# Altium project InsaneKeyboard_Right - Copy.PrjPcb (part 1 of 2)
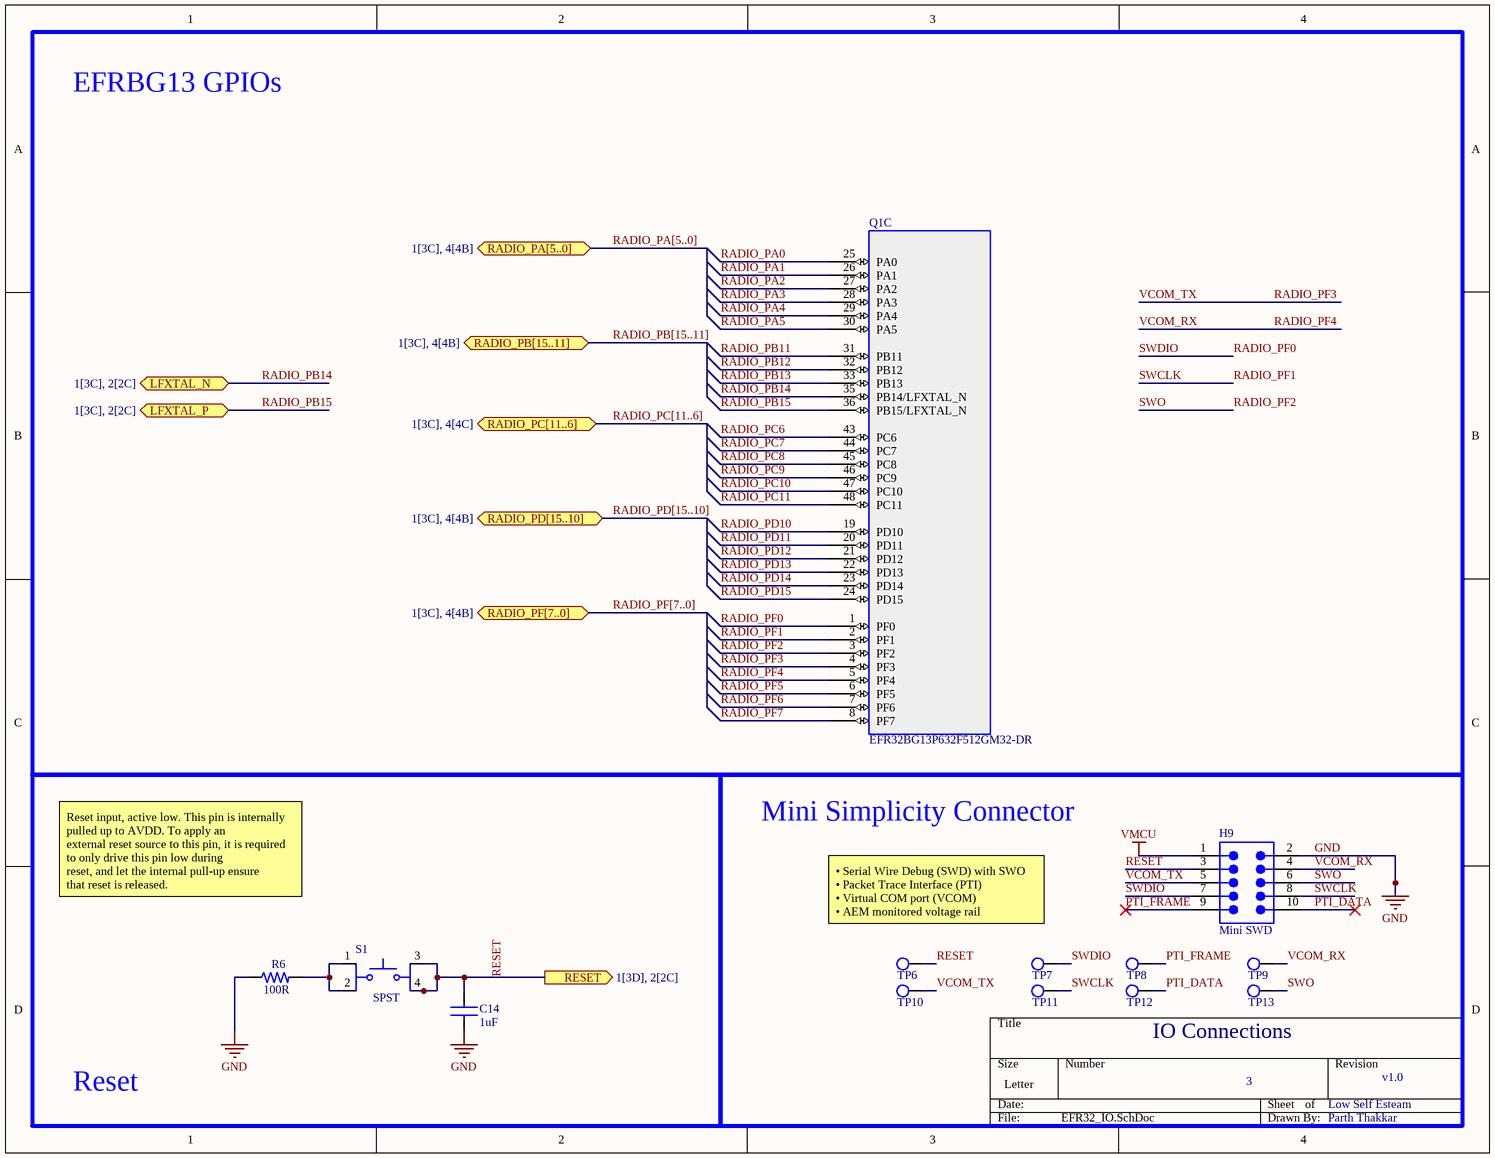
[diagram p0:  EFR32_IO.SchDoc]
3 sheets, 128 parts. Net scope: hierarchical (ports join the sheet entries above them; power ports are global).
Board file:  InsaneKeyboard.PcbDoc
Sheets:
   EFR32_IO.SchDoc
   Peripherals.SchDoc
   Lights.SchDoc

## Sheet  EFR32_IO.SchDoc: IO Connections
size Letter; Author: Parth Thakkar; Organization: Low Self Esteam; Revision: v1.0; SheetNumber: 3; SheetTotal: 8

### Parts
C14  value 1uF  [Capacitor 0603]  (hidden comment: CAP 1uF 10V 0603)
H9  Mini SWD  [Mini Simplicity Connector]
Q1  EFR32BG13P632F512GM32-DR  [EFR32BG]  (part C of 3)
R6  value 100R  [Resistor 0603]  (hidden comment: RES 100R 0603)
S1  SPST  [SPST]
TP6  Test point  [Test Point]  (value not drawn)  (no BOM)
TP7  Test point  [Test Point]  (value not drawn)  (no BOM)
TP8  Test point  [Test Point]  (value not drawn)  (no BOM)
TP9  Test point  [Test Point]  (value not drawn)  (no BOM)
TP10  Test point  [Test Point]  (value not drawn)  (no BOM)
TP11  Test point  [Test Point]  (value not drawn)  (no BOM)
TP12  Test point  [Test Point]  (value not drawn)  (no BOM)
TP13  Test point  [Test Point]  (value not drawn)  (no BOM)

### Blocks framed on the sheet
EFRBG13 GPIOs: Q1
Reset: C14 R6 S1
Mini Simplicity Connector: H9 TP6-TP13

### Ports
LFXTAL_N (bidir, see 1[3C], 2[2C]), LFXTAL_P (bidir, see 1[3C], 2[2C]), RADIO_PA[5..0] (bidir, see 1[3C], 4[4B]), RADIO_PB[15..11] (bidir, see 1[3C], 4[4B]), RADIO_PC[11..6] (bidir, see 1[3C], 4[4C]), RADIO_PD[15..10] (bidir, see 1[3C], 4[4B]), RADIO_PF[7..0] (bidir, see 1[3C], 4[4B]), RESET (out, see 1[3D], 2[2C])

### Nets
GND: C14.2 H9.2 R6.1
VMCU: H9.1
PTI_DATA: H9.10 TP12.1
PTI_FRAME: H9.9 TP8.1
RADIO_PA0: Q1.25(PA0)
RADIO_PA1: Q1.26(PA1)
RADIO_PA2: Q1.27(PA2)
RADIO_PA3: Q1.28(PA3)
RADIO_PA4: Q1.29(PA4)
RADIO_PA5: Q1.30(PA5)
RADIO_PB11: Q1.31(PB11)
RADIO_PB12: Q1.32(PB12)
RADIO_PB13: Q1.33(PB13)
RADIO_PB14: Q1.35(PB14/LFXTAL_N) ; port LFXTAL_N
RADIO_PB15: Q1.36(PB15/LFXTAL_N) ; port LFXTAL_P
RADIO_PC6: Q1.43(PC6)
RADIO_PC7: Q1.44(PC7)
RADIO_PC8: Q1.45(PC8)
RADIO_PC9: Q1.46(PC9)
RADIO_PC10: Q1.47(PC10)
RADIO_PC11: Q1.48(PC11)
RADIO_PD10: Q1.19(PD10)
RADIO_PD11: Q1.20(PD11)
RADIO_PD12: Q1.21(PD12)
RADIO_PD13: Q1.22(PD13)
RADIO_PD14: Q1.23(PD14)
RADIO_PD15: Q1.24(PD15)
RADIO_PF0: H9.7 Q1.1(PF0) TP7.1  [also labelled SWDIO]
RADIO_PF1: H9.8 Q1.2(PF1) TP11.1  [also labelled SWCLK]
RADIO_PF2: H9.6 Q1.3(PF2) TP13.1  [also labelled SWO]
RADIO_PF3: H9.5 Q1.4(PF3) TP10.1  [also labelled VCOM_TX]
RADIO_PF4: H9.4 Q1.5(PF4) TP9.1  [also labelled VCOM_RX]
RADIO_PF5: Q1.6(PF5)
RADIO_PF6: Q1.7(PF6)
RADIO_PF7: Q1.8(PF7)
RESET: C14.1 H9.3 S1.3 S1.4 TP6.1 ; port RESET
NetR6_2: R6.2 S1.1 S1.2

### Buses and harness runs
bus RADIO_PA[5..0] = port RADIO_PA[5..0]
bus RADIO_PB[15..11] = port RADIO_PB[15..11]
bus RADIO_PC[11..6] = port RADIO_PC[11..6]
bus RADIO_PD[15..10] = port RADIO_PD[15..10]
bus RADIO_PF[7..0] = port RADIO_PF[7..0]

### Notes on the sheet
- Reset input, active low. This pin is internally
  pulled up to AVDD. To apply an
  external reset source to this pin, it is required
  to only drive this pin low during
  reset, and let the internal pull-up ensure
  that reset is released.
- • Serial Wire Debug (SWD) with SWO
  • Packet Trace Interface (PTI)
  • Virtual COM port (VCOM)
  • AEM monitored voltage rail

### Library data of the parts
C14 = CAP 1uF 10V 0603: Ceramic Capacitor, Multilayer, Ceramic, 10V, 10% +Tol, 10% -Tol, X5R, 15% TC, 1uF, Surface Mount, 0603; Manufacturer: Murata; Manufacturer Part Number: GRM188R61A105KA61D; Multilayer: Yes; Supplier: Digikey; Supplier Part Number: 490-1543-1-ND; RoHS: Yes; Category: Ceramic Capacitors; Stock: 2506225; Pricing: 1=0.1, 10=0.059, 50=0.0408, 100=0.0354, 500=0.0261, 1000=0.02321 (USD); Mounting Technology: Surface Mount; Pins: 2; Dielectric Material: Ceramic; Package Shape: Rectangular; Case/Package: 0603; Terminal Finish: Nickel; Min Operating Temperature: -55°C; Max Operating Temperature: 85°C; JESD-609 Code: e3; Capacitor Type: Ceramic; Tolerance  (fill in as +-): 10%; Package Style: SMTMeter; Packaging: Tape and Reel; Tolerance (fill in as +-): 10%; Rated DC Voltage (URdc): 10V; Temperature Characteristics Code: X5R; Termination: Wraparound; Length: 1.6mm; Width: 0.8mm; Height: 0.8mm; Reach SVHC Compliant: Yes; RoHS Compliant: Yes; ComponentLink1URL: https://psearch.en.murata.com:443/capacitor/product/GRM188R61A105KA61%23.pdf?src-supplier=IHS+Markit; ComponentLink1Description: https://psearch.en.murata.com:443/capacitor/product/GRM188R61A105KA61%23.pdf?src-supplier=IHS+Markit; ComponentLink2URL: https://datasheet.ciiva.com/18102/getdatasheetpartid-85467-18102910.pdf?src-supplier=Verical; ComponentLink2Description: https://datasheet.ciiva.com/18102/getdatasheetpartid-85467-18102910.pdf?src-supplier=Verical; ComponentLink3URL: https://datasheet.ciiva.com/19476/1857381-19476568.pdf?src-supplier=Jameco; ComponentLink3Description: https://datasheet.ciiva.com/19476/1857381-19476568.pdf?src-supplier=Jameco; ComponentLink4URL: https://datasheet.ciiva.com/7719/608985-7719036.pdf?src-supplier=Element14; ComponentLink4Description: https://datasheet.ciiva.com/7719/608985-7719036.pdf?src-supplier=Element14; ComponentLink5URL: https://datasheet.ciiva.com/22706/608985-22706782.pdf?src-supplier=Element14; ComponentLink5Description: https://datasheet.ciiva.com/22706/608985-22706782.pdf?src-supplier=Element14; ComponentLink6URL: https://datasheet.ciiva.com/131/partnumbering-e-01-131741.pdf?src-supplier=Digikey; ComponentLink6Description: https://datasheet.ciiva.com/131/partnumbering-e-01-131741.pdf?src-supplier=Digikey; ComponentLink7URL: https://datasheet.ciiva.com/131/partnumbering-e-01-131742.pdf?src-supplier=Digikey; ComponentLink7Description: https://datasheet.ciiva.com/131/partnumbering-e-01-131742.pdf?src-supplier=Digikey; ComponentLink8URL: https://datasheet.ciiva.com/131/partnumbering-e-01-131743.pdf?src-supplier=Digikey; ComponentLink8Description: https://datasheet.ciiva.com/131/partnumbering-e-01-131743.pdf?src-supplier=Digikey; ComponentLink9URL: https://datasheet.ciiva.com/16199/product-16199724.pdf?src-supplier=Future+Electronics; ComponentLink9Description: https://datasheet.ciiva.com/16199/product-16199724.pdf?src-supplier=Future+Electronics
H9 = Debug Connector Mini SWD - 0.05": Mini SWD 0.05" Pitch Connector - 10 Pin SMT Box Header; Manufacturer: Adafruit Industries; Manufacturer Part Number: 4048; Supplier 1: Digi-Key; RoHS: No; Category: Connectors; Stock 1: 201; Pricing 1: 1=1.95000 (USD); ComponentLink1URL: https://media.digikey.com/pdf/Data%20Sheets/Adafruit%20PDFs/4048_Web.pdf?src-supplier=Digi-Key; ComponentLink1Description: https://media.digikey.com/pdf/Data%20Sheets/Adafruit%20PDFs/4048_Web.pdf?src-supplier=Digi-Key
Q1 = EFR32BG13P632F512GM32-DR: BLue Gecko; Manufacturer: Silicon Labs; Supplier: Digikey; Supplier Part Number: 336-EFR32BG13P632F512GM32-DRCT-ND; Manufacturer Part Number: EFR32BG13P632F512GM32-DR; RoHS: No; Category: RF Receivers, Transceivers; Stock: 30445; Pricing: 1=6.93, 10=6.355, 25=5.7772, 100=5.1995, 250=4.7662, 500=4.3329, 1000=3.89961 (USD); RoHS Compliant: Yes; ComponentLink1URL: https://www.silabs.com/documents/login/data-sheets/efr32bg13-datasheet.pdf?src-supplier=Digikey; ComponentLink1Description: https://www.silabs.com/documents/login/data-sheets/efr32bg13-datasheet.pdf?src-supplier=Digikey
R6 = RES 100R 0603: Fixed Resistor, Metal Glaze/thick Film, 0.1W, 100ohm, 75V, 1% +/-Tol, 100ppm/Cel, Surface Mount, 0603; Manufacturer: Yageo; Manufacturer Part Number: RC0603FR-07100RL; Additional Feature: LASER TRIMMABLE; Power: 100mW; Rated Temperature: 70°C; Temperature Coefficient: 100ppm/°C; Package Height: 0.45mm; Package Length: 1.6mm; Package Width: 0.8mm; Supplier: Digikey; Supplier Part Number: 311-100HRCT-ND; RoHS: Yes; Category: Chip SMD Resistors; Stock: 2134400; Pricing: 1=0.1, 10=0.019, 50=0.0112, 100=0.0093, 500=0.00622, 1000=0.00532, 5000=0.00382, 10000=0.00335, 25000=0.00287, 35000=0.00278, 50000=0.00257, 125000=0.00232 (USD); Mounting Technology: Surface Mount; Pins: 2; Package Shape: Rectangular; Case/Package: 0603; Terminal Finish: Nickel; Min Operating Temperature: -55°C; Max Operating Temperature: 155°C; Tolerance: 1%; JESD-609 Code: e3; Resistor Type: FIXED RESISTOR; Construction: Chip; Package Style: SMTMeter; Packaging: Tape and Reel; Technology: METAL GLAZE/THICK FILM; Termination: Wraparound; Working Voltage: 75V; Reach SVHC Compliant: Yes; RoHS Compliant: Yes; ComponentLink1URL: https://datasheet.ciiva.com:443/pdfs/VipMasterIC/IC/YAGO/YAGO-S-A0008145938/YAGO-S-A0008145938-1.pdf?src-supplier=IHS+Markit; ComponentLink1Description: https://datasheet.ciiva.com:443/pdfs/VipMasterIC/IC/YAGO/YAGO-S-A0008145938/YAGO-S-A0008145938-1.pdf?src-supplier=IHS+Markit
S1 = SPST: Keypad Switch, 1 Switches, SPST, Momentary-tactile, 0.05A, 50VDC, 2.55N, Solder Terminal, Surface Mount-straight; Manufacturer: E-Switch; Manufacturer Part Number: TL3301NF260QG; Circuit Configuration: 1X1; Contact Current(DC)-Max: 50mA; Contact DC Max Rating R Load: .05A@50VDC; Contact Voltage(DC)-Max: 50V; Number of Switches: 1; Operating Force-Max: 3.04N; Body Breadth: 6inch; Body Height: 3.6mm; Body Length or Diameter: 6mm; Supplier: Digikey; Supplier Part Number: EG1868CT-ND; RoHS: Yes; Category: Tactile Switches; Stock: 45667; Pricing: 1=0.42, 10=0.404, 25=0.3804, 100=0.3303, 250=0.29968, 500=0.27876 (USD); Mounting Technology: Surface Mount; Terminal Finish: Silver; JESD-609 Code: e4; Packaging: Tape and Reel; Switch Action: MOMENTARY-TACTILE; Switch Function: SPST; Switch Type: Keypad; Termination: Solder; Reach SVHC Compliant: Yes; RoHS Compliant: Yes; ComponentLink1URL: https://datasheet.ciiva.com:443/pdfs/VipMasterIC/IC/ESCH/ESCH-S-A0005350531/ESCH-S-A0005350531-1.pdf?src-supplier=IHS+Markit; ComponentLink1Description: https://datasheet.ciiva.com:443/pdfs/VipMasterIC/IC/ESCH/ESCH-S-A0005350531/ESCH-S-A0005350531-1.pdf?src-supplier=IHS+Markit; ComponentLink2URL: https://datasheet.ciiva.com/2901/p010517e-2901296.pdf?src-supplier=Digikey; ComponentLink2Description: https://datasheet.ciiva.com/2901/p010517e-2901296.pdf?src-supplier=Digikey; ComponentLink3URL: https://datasheet.ciiva.com/2901/tl3301-2901294.pdf?src-supplier=Digikey; ComponentLink3Description: https://datasheet.ciiva.com/2901/tl3301-2901294.pdf?src-supplier=Digikey; ComponentLink4URL: https://datasheet.ciiva.com/2901/tl3301-2901295.pdf?src-supplier=Digikey; ComponentLink4Description: https://datasheet.ciiva.com/2901/tl3301-2901295.pdf?src-supplier=Digikey; ComponentLink5URL: https://datasheet.ciiva.com/7637/tl3301-7637661.pdf?src-supplier=Element14; ComponentLink5Description: https://datasheet.ciiva.com/7637/tl3301-7637661.pdf?src-supplier=Element14

## Sheet  Peripherals.SchDoc: Peripharals
size Letter; Author: Parth Thakkar; CompanyName: Insane Corp; Organization: Low Self Esteem; SheetNumber: 4; SheetTotal: 8
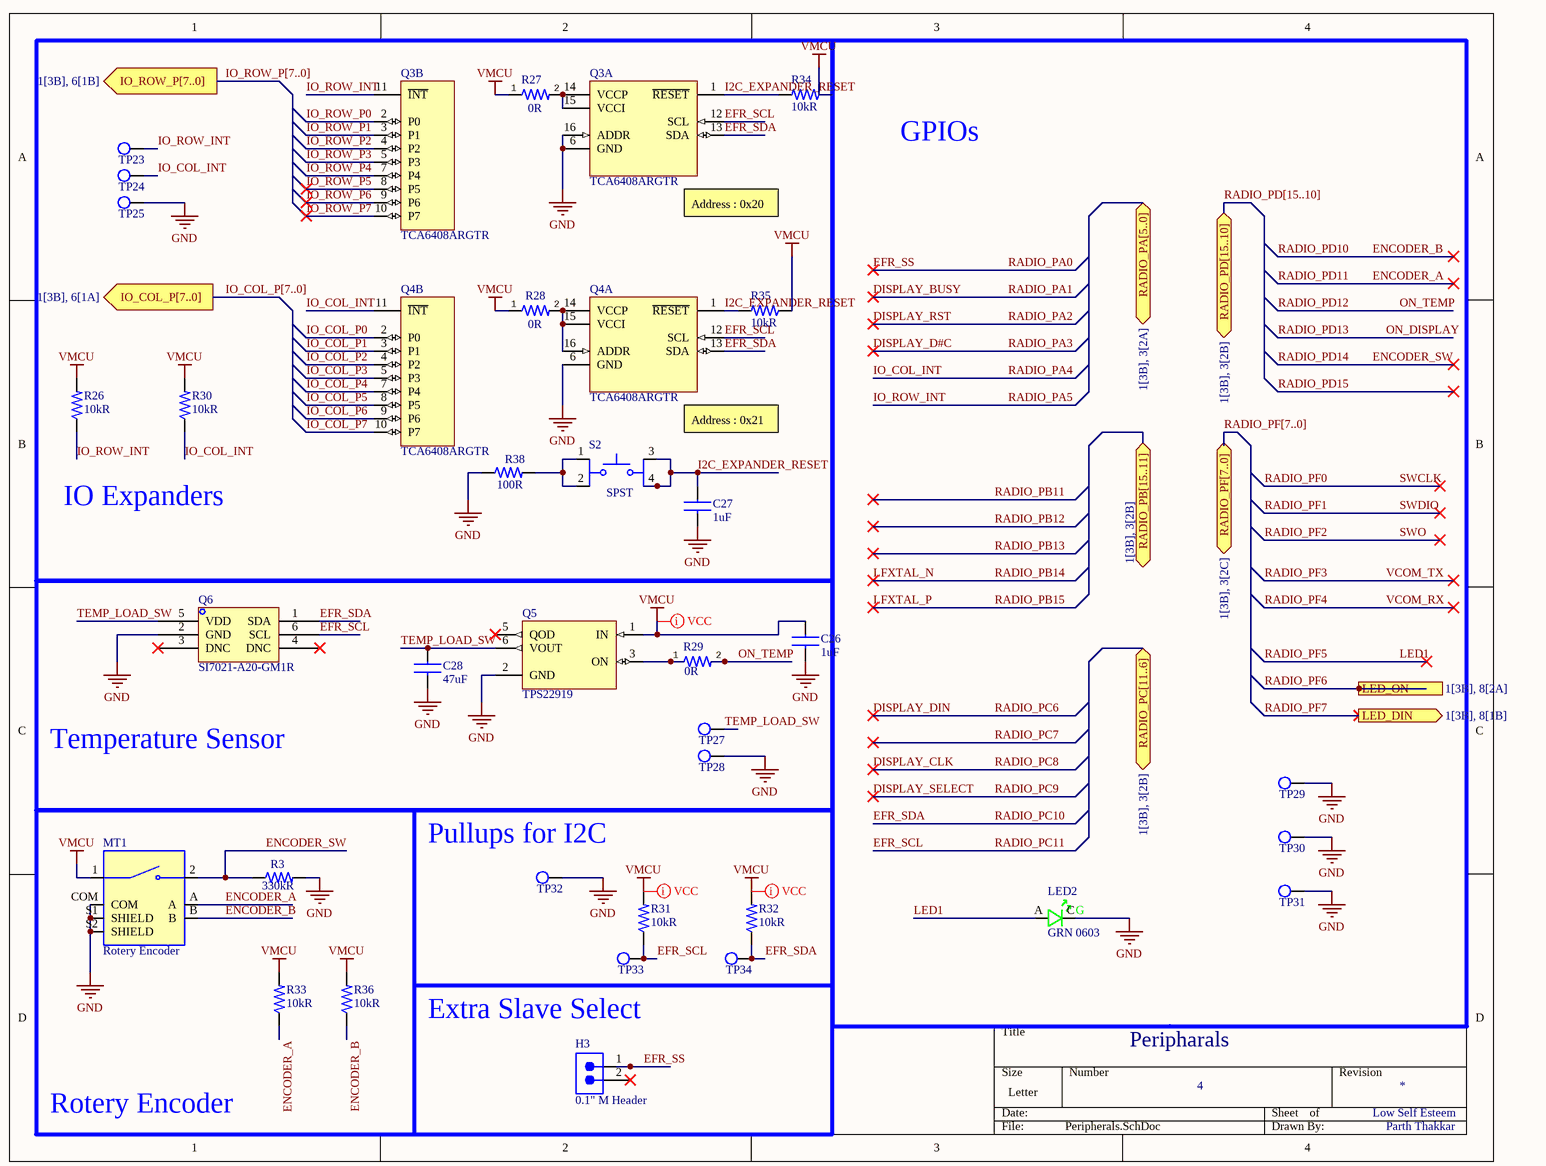
[diagram p1:  Peripherals.SchDoc]

### Parts
C26  value 1uF  [Capacitor 0603]  (hidden comment: CAP 1uF 10V 0603)
C27  value 1uF  [Capacitor 0603]  (hidden comment: CAP 1uF 10V 0603)
C28  value 47uF  [CAPACITOR 0805]  (hidden comment: CAP 47uF 10V 0805)
H3  0.1" M Header  [2-PIN_MALE_HEADER_01-IN]
LED2  GRN 0603  [LED 0603]
MT1  Rotery Encoder  [Rotery Encoder]
Q3  TCA6408ARGTR  [TCA6408ARGTR - IO Expander]  (parts A,B of 2)
Q4  TCA6408ARGTR  [TCA6408ARGTR - IO Expander]  (parts A,B of 2)
Q5  TPS22919  [TPS22919DCKR - Load SW]
Q6  SI7021-A20-GM1R  [Si7021-A20 - Temp]
R3  value 330kR  [Resistor 0603]  (hidden comment: RES 330K 0603)
R26  value 10kR  [Resistor 0603]  (hidden comment: RES 10K 0603)
R27  value 0R  [Resistor 0402]  (hidden comment: RES 0R 0402)
R28  value 0R  [Resistor 0402]  (hidden comment: RES 0R 0402)
R29  value 0R  [Resistor 0402]  (hidden comment: RES 0R 0402)
R30  value 10kR  [Resistor 0603]  (hidden comment: RES 10K 0603)
R31  value 10kR  [Resistor 0603]  (hidden comment: RES 10K 0603)
R32  value 10kR  [Resistor 0603]  (hidden comment: RES 10K 0603)
R33  value 10kR  [Resistor 0603]  (hidden comment: RES 10K 0603)
R34  value 10kR  [Resistor 0603]  (hidden comment: RES 10K 0603)
R35  value 10kR  [Resistor 0603]  (hidden comment: RES 10K 0603)
R36  value 10kR  [Resistor 0603]  (hidden comment: RES 10K 0603)
R38  value 100R  [Resistor 0603]  (hidden comment: RES 100R 0603)
S2  SPST  [SPST]
TP23  Test point  [Test Point]  (value not drawn)  (no BOM)
TP24  Test point  [Test Point]  (value not drawn)  (no BOM)
TP25  Test point  [Test Point]  (value not drawn)  (no BOM)
TP27  Test point  [Test Point]  (value not drawn)  (no BOM)
TP28  Test point  [Test Point]  (value not drawn)  (no BOM)
TP29  Test point  [Test Point]  (value not drawn)  (no BOM)
TP30  Test point  [Test Point]  (value not drawn)  (no BOM)
TP31  Test point  [Test Point]  (value not drawn)  (no BOM)
TP32  Test point  [Test Point]  (value not drawn)  (no BOM)
TP33  Test point  [Test Point]  (value not drawn)  (no BOM)
TP34  Test point  [Test Point]  (value not drawn)  (no BOM)

### Blocks framed on the sheet
IO Expanders: C27 Q3 Q4 R26-R28 R30 R34 R35 R38 S2 TP23-TP25
GPIOs: LED2 TP29-TP31
Temperature Sensor: C26 C28 Q5 Q6 R29 TP27 TP28
Rotery Encoder: MT1 R3 R33 R36
Pullups for I2C: R31 R32 TP32-TP34
Extra Slave Select: H3

### Ports
IO_COL_P[7..0] (out, see 1[3B], 6[1A]), IO_ROW_P[7..0] (out, see 1[3B], 6[1B]), LED_DIN (out, see 1[3B], 8[1B]), LED_ON (out, see 1[3B], 8[2A]), RADIO_PA[5..0] (bidir, see 1[3B], 3[2A]), RADIO_PB[15..11] (bidir, see 1[3B], 3[2B]), RADIO_PC[11..6] (bidir, see 1[3B], 3[2B]), RADIO_PD[15..10] (bidir, see 1[3B], 3[2B]), RADIO_PF[7..0] (bidir, see 1[3B], 3[2C])

### Nets
GND: C26.2 C27.2 C28.2 LED2.C MT1.COM MT1.S1(SHIELD) MT1.S2(SHIELD) Q3.6(GND) Q3.16(ADDR) Q4.6(GND) Q5.2(GND) Q6.2(GND) R3.2 R38.1 TP25.1 TP28.1 TP29.1 TP30.1 TP31.1 TP32.1
VMCU: C26.1 MT1.1 Q5.1(IN) R26.2 R27.1 R28.1 R30.2 R31.2 R32.2 R33.2 R34.1 R35.1 R36.2
EFR_SCL: Q3.12(SCL) Q4.12(SCL) Q6.6(SCL) R31.1 TP33.1  [also labelled RADIO_PC11]
EFR_SDA: Q3.13(SDA) Q4.13(SDA) Q6.1(SDA) R32.1 TP34.1  [also labelled RADIO_PC10]
EFR_SS: H3.1  [also labelled RADIO_PA0]
ENCODER_A: MT1.A R33.1  [also labelled RADIO_PD11]
ENCODER_B: MT1.B R36.1  [also labelled RADIO_PD10]
ENCODER_SW: MT1.2 R3.1  [also labelled RADIO_PD14]
I2C_EXPANDER_RESET: C27.1 Q3.1(~{RESET}) Q4.1(~{RESET}) R34.2 R35.2 S2.3 S2.4
IO_COL_INT: Q4.11(~{INT}) R30.1 TP24.1  [also labelled RADIO_PA4]
IO_COL_P0: Q4.2(P0)
IO_COL_P1: Q4.3(P1)
IO_COL_P2: Q4.4(P2)
IO_COL_P3: Q4.5(P3)
IO_COL_P4: Q4.7(P4)
IO_COL_P5: Q4.8(P5)
IO_COL_P6: Q4.9(P6)
IO_COL_P7: Q4.10(P7)
IO_ROW_INT: Q3.11(~{INT}) R26.1 TP23.1  [also labelled RADIO_PA5]
IO_ROW_P0: Q3.2(P0)
IO_ROW_P1: Q3.3(P1)
IO_ROW_P2: Q3.4(P2)
IO_ROW_P3: Q3.5(P3)
IO_ROW_P4: Q3.7(P4)
IO_ROW_P5: Q3.8(P5)
IO_ROW_P6: Q3.9(P6)
IO_ROW_P7: Q3.10(P7)
LED1: LED2.A  [also labelled RADIO_PF5]
ON_TEMP: R29.2  [also labelled RADIO_PD12]
RADIO_PF6: port LED_ON
RADIO_PF7: port LED_DIN
TEMP_LOAD_SW: C28.1 Q5.6(VOUT) Q6.5(VDD) TP27.1
NetQ3_14: Q3.14(VCCP) Q3.15(VCCI) R27.2
NetQ4_14: Q4.14(VCCP) Q4.15(VCCI) Q4.16(ADDR) R28.2
NetQ5_3: Q5.3(ON) R29.1
NetR38_2: R38.2 S2.1 S2.2

Not connected (* = marked no-connect by the designer): H3 2*; Q5 5(QOD)*; Q6 3(DNC)* 4(DNC)*

### Buses and harness runs
bus IO_COL_P[7..0] = port IO_COL_P[7..0]
bus IO_ROW_P[7..0] = port IO_ROW_P[7..0]
bus RADIO_PD[15..10] = port RADIO_PD[15..10]
bus RADIO_PF[7..0] = port RADIO_PF[7..0]

### Layout directives
rule Width Constraint [Pref Width = 20mil    Min Width = 6mil    Max Width = 20mil]: VMCU

### Notes on the sheet
- (near Q3) Address : 0x20
- Address : 0x21

### Library data of the parts
C26 C27 = CAP 1uF 10V 0603: as C14 on sheet  EFR32_IO; Supplier: Digikey; Supplier Part Number: 490-1543-1-ND; RoHS: Yes; Category: Ceramic Capacitors; Stock: 2506225; Pricing: 1=0.1, 10=0.059, 50=0.0408, 100=0.0354, 500=0.0261, 1000=0.02321 (USD); Mounting Technology: Surface Mount; Pins: 2; Dielectric Material: Ceramic; Package Shape: Rectangular; Case/Package: 0603; Terminal Finish: Nickel; Min Operating Temperature: -55°C; Max Operating Temperature: 85°C; JESD-609 Code: e3; Capacitor Type: Ceramic; Tolerance  (fill in as +-): 10%; Package Style: SMTMeter; Packaging: Tape and Reel; Tolerance (fill in as +-): 10%; Rated DC Voltage (URdc): 10V; Temperature Characteristics Code: X5R; Termination: Wraparound; Length: 1.6mm; Width: 0.8mm; Height: 0.8mm; Reach SVHC Compliant: Yes; RoHS Compliant: Yes; ComponentLink1URL: https://psearch.en.murata.com:443/capacitor/product/GRM188R61A105KA61%23.pdf?src-supplier=IHS+Markit; ComponentLink1Description: https://psearch.en.murata.com:443/capacitor/product/GRM188R61A105KA61%23.pdf?src-supplier=IHS+Markit; ComponentLink2URL: https://datasheet.ciiva.com/18102/getdatasheetpartid-85467-18102910.pdf?src-supplier=Verical; ComponentLink2Description: https://datasheet.ciiva.com/18102/getdatasheetpartid-85467-18102910.pdf?src-supplier=Verical; ComponentLink3URL: https://datasheet.ciiva.com/19476/1857381-19476568.pdf?src-supplier=Jameco; ComponentLink3Description: https://datasheet.ciiva.com/19476/1857381-19476568.pdf?src-supplier=Jameco; ComponentLink4URL: https://datasheet.ciiva.com/7719/608985-7719036.pdf?src-supplier=Element14; ComponentLink4Description: https://datasheet.ciiva.com/7719/608985-7719036.pdf?src-supplier=Element14; ComponentLink5URL: https://datasheet.ciiva.com/22706/608985-22706782.pdf?src-supplier=Element14; ComponentLink5Description: https://datasheet.ciiva.com/22706/608985-22706782.pdf?src-supplier=Element14; ComponentLink6URL: https://datasheet.ciiva.com/131/partnumbering-e-01-131741.pdf?src-supplier=Digikey; ComponentLink6Description: https://datasheet.ciiva.com/131/partnumbering-e-01-131741.pdf?src-supplier=Digikey; ComponentLink7URL: https://datasheet.ciiva.com/131/partnumbering-e-01-131742.pdf?src-supplier=Digikey; ComponentLink7Description: https://datasheet.ciiva.com/131/partnumbering-e-01-131742.pdf?src-supplier=Digikey; ComponentLink8URL: https://datasheet.ciiva.com/131/partnumbering-e-01-131743.pdf?src-supplier=Digikey; ComponentLink8Description: https://datasheet.ciiva.com/131/partnumbering-e-01-131743.pdf?src-supplier=Digikey; ComponentLink9URL: https://datasheet.ciiva.com/16199/product-16199724.pdf?src-supplier=Future+Electronics; ComponentLink9Description: https://datasheet.ciiva.com/16199/product-16199724.pdf?src-supplier=Future+Electronics
C28 = CAP 47uF 10V 0805: Multilayer Ceramic Capacitors MLCC - SMD/SMT 0805 47uF 10volts *Derate Voltage/Temp; Manufacturer: Murata; Manufacturer Part Number: GRM21BR61A476ME15K; Tolerance: 20%; Dielectric: X5R; Supplier: Digikey; Supplier Part Number: 490-GRM21BR61A476ME15KCT-ND; RoHS: Yes; Category: Ceramic Capacitors; Stock: 143272; Pricing: 1=0.72, 10=0.435, 50=0.3216, 100=0.2864, 500=0.22636, 1000=0.20762, 2500=0.18771, 5000=0.17563 (USD); Mounting Technology: Surface Mount; Case/Package: 0805; Case Code (Imperial): 0805; Case Code (Metric): 2012; Weight: 0.000335oz; Material: Ceramic; Min Operating Temperature: -55°C; Max Operating Temperature: 85°C; Packaging: Tape and Reel; Voltage Rating: 10V; Termination: SMD/SMT; Voltage Rating (DC): 10V; Package Quantity: 10000; Series: GRM; Height: 1.45mm; RoHS Compliant: Yes; ComponentLink1URL: http://www.mouser.com/ds/2/281/c02e-2905.pdf?src-supplier=Mouser; ComponentLink1Description: http://www.mouser.com/ds/2/281/c02e-2905.pdf?src-supplier=Mouser; ComponentLink2URL: https://www.murata.com/~/media/webrenewal/support/library/catalog/products/capacitor/mlcc/c02e.ashx?la=en-us&src-supplier=Digikey; ComponentLink2Description: https://www.murata.com/~/media/webrenewal/support/library/catalog/products/capacitor/mlcc/c02e.ashx?la=en-us&src-supplier=Digikey; ComponentLink3URL: http://psearch.en.murata.com/capacitor/product/GRM21BR61A476ME15%23.pdf?src-supplier=Avnet; ComponentLink3Description: http://psearch.en.murata.com/capacitor/product/GRM21BR61A476ME15%23.pdf?src-supplier=Avnet; ComponentLink4URL: https://datasheet.octopart.com/GRM21BR61A476ME15K-Murata-datasheet-155345080.pdf?src-supplier=Newark; ComponentLink4Description: https://datasheet.octopart.com/GRM21BR61A476ME15K-Murata-datasheet-155345080.pdf?src-supplier=Newark; ComponentLink5URL: https://datasheet.octopart.com/GRM21BR61A476ME15K-Murata-datasheet-141278181.pdf?src-supplier=Future+Electronics; ComponentLink5Description: https://datasheet.octopart.com/GRM21BR61A476ME15K-Murata-datasheet-141278181.pdf?src-supplier=Future+Electronics; ComponentLink6URL: https://datasheet.octopart.com/GRM21BR61A476ME15K-Murata-datasheet-155345080.pdf?src-supplier=Element14; ComponentLink6Description: https://datasheet.octopart.com/GRM21BR61A476ME15K-Murata-datasheet-155345080.pdf?src-supplier=Element14; ComponentLink7URL: https://datasheet.octopart.com/GRM21BR61A476ME15K-Murata-datasheet-165579666.pdf?src-supplier=TME; ComponentLink7Description: https://datasheet.octopart.com/GRM21BR61A476ME15K-Murata-datasheet-165579666.pdf?src-supplier=TME
H3 = PRPC002SAAN-RC: CONN HEADER VERT 2POS 2.54MM; Manufacturer: Sullins; Connector Type: Header, Unshrouded, Breakaway; Number of Positions: 2; Number of Positions Loaded: All; Pitch: 0.100" (2.54mm); Online Catalog: 0.100" (2.54mm) Pitch Connector Headers; Other Names: S9510E-02  S9510E-02-ND; Supplier 1: Digi-Key; Manufacturer Part Number: PRPC002SAAN-RC; Stock 1: 42739; Pricing 1: 1=0.08, 10=0.073, 25=0.054, 50=0.0464, 100=0.0449, 250=0.0387, 500=0.0372 (USD); Standard Package: 1; Category: Connectors, Interconnects; Family: Rectangular Connectors - Headers, Male Pins; Series: -; Packaging: Bulk; Contact Type: Male Pin; Number of Rows: 1; Row Spacing: -; Contact Mating Length: 0.230" (5.84mm); Mounting Type: Through Hole; Termination: Solder; Fastening Type: -; Features: -; Contact Finish: Gold; Contact Finish Thickness: Flash; Color: Black; ComponentLink1URL: https://media.digikey.com/PDF/Data%20Sheets/Sullins%20PDFs/xRxCzzzSxxN-RC_ST_11635-B.pdf?src-supplier=Digi-Key; ComponentLink1Description: https://media.digikey.com/PDF/Data%20Sheets/Sullins%20PDFs/xRxCzzzSxxN-RC_ST_11635-B.pdf?src-supplier=Digi-Key; Supplier Part Number 1: S1011EC-02-ND
LED2 = LED Green 0603: LED, 0603, GREEN, 430MCD, 520NM; Manufacturer: Wurth Electronics; Manufacturer Part Number: 150060GS75000; Dynamic Catalog: 0603 Rectangle with Flat Top Chip LEDs; 3D Model: SMCW_0603.igs / SMCW_0603.stp / SMCW_0603.wrl; Wavelength - Peak: 515nm; Voltage - Forward (Vf) (Typ): 3.2V; Current - Test: 20mA; Viewing Angle: 140°; Lens Type: Clear; Lens Style/Size: Rectangle with Flat Top, 1.1mm x 0.7mm; Other Names: 732-4971-2; Supplier 1: Digi-Key; Stock 1: 34964; Pricing 1: 1=0.14, 50=0.129, 100=0.11, 500=0.095 (USD); Standard Package: 4,000; Category: Optoelectronics; Family: LED Indication - Discrete; Series: WL-SMCW; Packaging: Tape & Reel (TR); Color: Green; Wavelength - Dominant: 520nm; Millicandela Rating: 430mcd; Package / Case: 0603 (1608 Metric); Size / Dimension: 1.60mm L x 0.80mm W; Height: 0.70mm; Mounting Type: Surface Mount; Online Catalog: 0603 Rectangle with Flat Top Chip LEDs; ComponentLink1URL: https://katalog.we-online.de/led/datasheet/150060GS75000.pdf?src-supplier=Digi-Key; ComponentLink1Description: https://katalog.we-online.de/led/datasheet/150060GS75000.pdf?src-supplier=Digi-Key; ComponentLink2URL: http://www.produktinfo.conrad.com/datenblaetter/750000-774999/759427-da-01-en-CHIPLED_0603_W_KL_GRUEN_150060GS75000.pdf?src-supplier=Conrad; ComponentLink2Description: http://www.produktinfo.conrad.com/datenblaetter/750000-774999/759427-da-01-en-CHIPLED_0603_W_KL_GRUEN_150060GS75000.pdf?src-supplier=Conrad; Supplier Part Number 1: 732-4971-1-ND
MT1 = Rotery Encoder: Rotary Position Encoder, Single, 2 Channels; Manufacturer: Bourns; Manufacturer Part Number: PEC12R-4222F-S0024; MP: PEC11R-4215F-S0024; Channels: 1; Price: None; Availability: Unavailable; Value: *; Package: None; Supplier: Digikey; Supplier Part Number: PEC12R-4222F-S0024-ND; RoHS: Yes; Category: Encoders; Stock: 991; Pricing: 1=1.62, 5=1.53, 10=1.431, 25=1.3148, 75=1.22787, 150=1.108, 300=1.04813, 450=0.98824, 975=0.92834 (USD); Min Operating Temperature: -30°C; Max Operating Temperature: 70°C; Optoelectronic Device Type: ROTARY POSITION ENCODER; RoHS Compliant: Yes; Reach SVHC Compliant: Yes; ComponentLink1URL: https://datasheet.ciiva.com:443/pdfs/VipMasterIC/IC/BOUR/BOUR-S-A0008996893/BOUR-S-A0008996893-1.pdf?src-supplier=IHS+Markit; ComponentLink1Description: https://datasheet.ciiva.com:443/pdfs/VipMasterIC/IC/BOUR/BOUR-S-A0008996893/BOUR-S-A0008996893-1.pdf?src-supplier=IHS+Markit; ComponentLink2URL: http://www.mouser.com/ds/2/54/EC12R-777795.pdf?src-supplier=Mouser; ComponentLink2Description: http://www.mouser.com/ds/2/54/EC12R-777795.pdf?src-supplier=Mouser; ComponentLink3URL: https://www.bourns.com/docs/Product-Datasheets/PEC12R.pdf?src-supplier=Digikey; ComponentLink3Description: https://www.bourns.com/docs/Product-Datasheets/PEC12R.pdf?src-supplier=Digikey; ComponentLink4URL: http://www.bourns.com/data/global/pdfs/PEC12R.pdf?src-supplier=Avnet; ComponentLink4Description: http://www.bourns.com/data/global/pdfs/PEC12R.pdf?src-supplier=Avnet
Q3 Q4 = TCA6408ARGTR: Parallel I/O Port, 8-Bit, 8 I/O, CMOS, PQCC16; Manufacturer: Texas Instruments; Package Body Material: Plastic; Number of Bits: 8; Number of Ports: 1; Package Equivalence Code: LCC16,.12SQ,20; Power Supplies: 1.8/5V; Max Supply Voltage: 5.5V; Min Supply Voltage: 1.65V; Nominal Supply Voltage: 1.8V; Qualification Status: Not Qualified; Supplier: Digikey; Supplier Part Number: 296-24825-1-ND; Manufacturer Part Number: TCA6408ARGTR; RoHS: Yes; Category: Integrated Circuits (ICs); Stock: 16670; Pricing: 1=1.03, 10=0.723, 25=0.6464, 100=0.5638, 250=0.68844, 500=0.6084, 1000=0.56375, 3000=0.56375 (USD); Case/Package: HVQCCN; Pins: 16; Package Shape: Square; Terminal Finish: Nickel; Min Operating Temperature: -40°C; Max Operating Temperature: 85°C; JESD-609 Code: e4; JESD-30 Code: S-PQCC-N16; Moisture Sensitivity Level: 2; Number of I/O Lines: 8; Package Style: CHIP CARRIER, HEAT SINK/SLUG, VERY THIN PROFILEMeter; Peak Reflow Temperature (Cel): 260°C; Surface Mount: Yes; Technology: CMOS; Terminal Form: No Lead; Terminal Position: QUAD; Length: 3mm; Width: 3mm; Height - Seated (Max): 1mm; Terminal Pitch: 0.5mm; Temperature Grade: INDUSTRIAL; Reach SVHC Compliant: Yes; RoHS Compliant: Yes; ComponentLink1URL: https://www.ti.com:443/lit/ds/symlink/tca6408a.pdf?src-supplier=IHS+Markit; ComponentLink1Description: https://www.ti.com:443/lit/ds/symlink/tca6408a.pdf?src-supplier=IHS+Markit; ComponentLink2URL: https://datasheet.ciiva.com/14194/tca6408a-14194304.pdf?src-supplier=Avnet; ComponentLink2Description: https://datasheet.ciiva.com/14194/tca6408a-14194304.pdf?src-supplier=Avnet; ComponentLink3URL: https://datasheet.ciiva.com/15134/getdatasheetpartid-186211-15134441.pdf?src-supplier=Verical; ComponentLink3Description: https://datasheet.ciiva.com/15134/getdatasheetpartid-186211-15134441.pdf?src-supplier=Verical; ComponentLink4URL: https://datasheet.ciiva.com/41460/001187862-da-01-en-ic-i-o-expander-tca6408argtr-qfn-16-tid-41460603.pdf?src-supplier=Conrad; ComponentLink4Description: https://datasheet.ciiva.com/41460/001187862-da-01-en-ic-i-o-expander-tca6408argtr-qfn-16-tid-41460603.pdf?src-supplier=Conrad; ComponentLink5URL: https://datasheet.ciiva.com/1780/tca6408a-1780312.pdf?src-supplier=Digikey; ComponentLink5Description: https://datasheet.ciiva.com/1780/tca6408a-1780312.pdf?src-supplier=Digikey; ComponentLink6URL: https://datasheet.ciiva.com/1780/tca6408a-1780313.pdf?src-supplier=Digikey; ComponentLink6Description: https://datasheet.ciiva.com/1780/tca6408a-1780313.pdf?src-supplier=Digikey; ComponentLink7URL: https://datasheet.ciiva.com/1780/tca6408a-1780314.pdf?src-supplier=Digikey; ComponentLink7Description: https://datasheet.ciiva.com/1780/tca6408a-1780314.pdf?src-supplier=Digikey
Q5 = TPS22919: Buffer/Inverter Based Peripheral Driver, 3A, PDSO6; Manufacturer: Texas Instruments; Manufacturer Part Number: TPS22919DCKT; Supplier: Mouser; Supplier Part Number: 595-TPS22919DCKT; RoHS: Yes; Category: Power Management ICs; Stock: 6490; Pricing: 1=0.94, 10=0.712, 50=0.712, 100=0.413, 1000=0.308, 10000=0.308 (USD); ComponentLink1URL: https://www.ti.com:443/lit/ds/symlink/tps22919.pdf?src-supplier=IHS+Markit; ComponentLink1Description: https://www.ti.com:443/lit/ds/symlink/tps22919.pdf?src-supplier=IHS+Markit; ComponentLink2URL: http://www.ti.com/general/docs/suppproductinfo.tsp?distId=10&amp;gotoUrl=http%3A%2F%2Fwww.ti.com%2Flit%2Fgpn%2Ftps22919&src-supplier=Digikey; ComponentLink2Description: http://www.ti.com/general/docs/suppproductinfo.tsp?distId=10&amp;gotoUrl=http%3A%2F%2Fwww.ti.com%2Flit%2Fgpn%2Ftps22919&src-supplier=Digikey
Q6 = SI7021-A20-GM1R: Serial Switch/Digital Sensor, 14 Bit(s), 0.40Cel, Square, Surface Mount; Manufacturer: Silicon Labs; Accuracy-Max (Cel): 0.4°C; Number of Bits: 14; Operating Current-Max: 4mA; Output Interface Type: I2C; Sensor Type: TEMPERATURE SENSOR,SWITCH/DIGITAL OUTPUT,SERIAL; Max Supply Voltage: 3.6V; Min Supply Voltage: 1.9V; Body Breadth: 3inch; Body Height: 1.21mm; Body Length or Diameter: 3mm; Supplier: Digikey; Supplier Part Number: 336-4380-1-ND; Manufacturer Part Number: SI7021-A20-GM1R; RoHS: Yes; Category: Temperature and Humidity Sensors; Stock: 4090; Pricing: 1=11, 5=9.27, 10=8.614, 25=7.8184, 50=7.2658, 100=6.7525, 500=5.69712, 1000=5.29528 (USD); Mounting Technology: Surface Mount; Package Shape/Style: Square; Min Operating Temperature: -40°C; Max Operating Temperature: 85°C; Termination: Solder; Reach SVHC Compliant: Yes; RoHS Compliant: Yes; ComponentLink1URL: https://datasheet.ciiva.com:443/pdfs/VipMasterIC/IC/SILC/SILC-S-A0009375758/SILC-S-A0009375758-1.pdf?src-supplier=IHS+Markit; ComponentLink1Description: https://datasheet.ciiva.com:443/pdfs/VipMasterIC/IC/SILC/SILC-S-A0009375758/SILC-S-A0009375758-1.pdf?src-supplier=IHS+Markit; ComponentLink2URL: https://www.silabs.com/documents/public/data-sheets/Si7021-A20.pdf?src-supplier=Farnell; ComponentLink2Description: https://www.silabs.com/documents/public/data-sheets/Si7021-A20.pdf?src-supplier=Farnell; ComponentLink3URL: https://www.silabs.com/documents/public/data-sheets/Si7021-A20.pdf?src-supplier=Digikey; ComponentLink3Description: https://www.silabs.com/documents/public/data-sheets/Si7021-A20.pdf?src-supplier=Digikey; ComponentLink4URL: https://www.silabs.com/Support%20Documents%2fTechnicalDocs%2fSi7021-A20.pdf?src-supplier=Digikey; ComponentLink4Description: https://www.silabs.com/Support%20Documents%2fTechnicalDocs%2fSi7021-A20.pdf?src-supplier=Digikey; ComponentLink5URL: https://www.silabs.com/Support%20Documents/TechnicalDocs/Si7021-A20.pdf?src-supplier=Avnet; ComponentLink5Description: https://www.silabs.com/Support%20Documents/TechnicalDocs/Si7021-A20.pdf?src-supplier=Avnet; ComponentLink6URL: https://www.silabs.com/documents/public/data-sheets/Si7021-A20.pdf?src-supplier=Newark; ComponentLink6Description: https://www.silabs.com/documents/public/data-sheets/Si7021-A20.pdf?src-supplier=Newark; ComponentLink7URL: https://datasheet.octopart.com/SI7021-A20-GM1R-Silicon-Labs-datasheet-134531215.pdf?src-supplier=LKR; ComponentLink7Description: https://datasheet.octopart.com/SI7021-A20-GM1R-Silicon-Labs-datasheet-134531215.pdf?src-supplier=LKR
R3 = RES 330K 0603: Fixed Resistor, Metal Glaze/thick Film, 0.1W, 330000ohm, 75V, 5% +/-Tol, 100ppm/Cel, Surface Mount, 0603; Manufacturer: Yageo; Manufacturer Part Number: RC0603JR-07330KL; Additional Feature: LASER TRIMMABLE; Power: 100mW; Rated Temperature: 70°C; Temperature Coefficient: 100ppm/°C; Package Height: 0.45mm; Package Length: 1.6mm; Package Width: 0.8mm; Supplier: Digikey; Supplier Part Number: 311-330KGRCT-ND; RoHS: Yes; Category: Chip SMD Resistors; Stock: 461691; Pricing: 1=0.1, 10=0.011, 50=0.0066, 100=0.0054, 500=0.0036, 1000=0.00307 (USD); Mounting Technology: Surface Mount; Pins: 2; Package Shape: Rectangular; Case/Package: 0603; Terminal Finish: Nickel; Min Operating Temperature: -55°C; Max Operating Temperature: 155°C; Tolerance: 5%; JESD-609 Code: e3; Resistor Type: FIXED RESISTOR; Construction: Chip; Package Style: SMTMeter; Packaging: Tape and Reel; Technology: METAL GLAZE/THICK FILM; Termination: Wraparound; Working Voltage: 75V; Reach SVHC Compliant: Yes; RoHS Compliant: Yes; ComponentLink1URL: https://datasheet.ciiva.com:443/pdfs/VipMasterIC/IC/YAGO/YAGO-S-A0008145938/YAGO-S-A0008145938-1.pdf?src-supplier=IHS+Markit; ComponentLink1Description: https://datasheet.ciiva.com:443/pdfs/VipMasterIC/IC/YAGO/YAGO-S-A0008145938/YAGO-S-A0008145938-1.pdf?src-supplier=IHS+Markit; ComponentLink2URL: https://datasheet.ciiva.com/7746/443971-7746485.pdf?src-supplier=Element14; ComponentLink2Description: https://datasheet.ciiva.com/7746/443971-7746485.pdf?src-supplier=Element14; ComponentLink3URL: https://datasheet.ciiva.com/7746/443971-7746486.pdf?src-supplier=Element14; ComponentLink3Description: https://datasheet.ciiva.com/7746/443971-7746486.pdf?src-supplier=Element14; ComponentLink4URL: https://datasheet.ciiva.com/2453/pyu-r-int-thick-7-2453220.pdf?src-supplier=Digikey; ComponentLink4Description: https://datasheet.ciiva.com/2453/pyu-r-int-thick-7-2453220.pdf?src-supplier=Digikey; ComponentLink5URL: https://datasheet.ciiva.com/2453/pyu-r-int-thick-7-2453221.pdf?src-supplier=Digikey; ComponentLink5Description: https://datasheet.ciiva.com/2453/pyu-r-int-thick-7-2453221.pdf?src-supplier=Digikey; ComponentLink6URL: https://datasheet.ciiva.com/2453/pyu-r-int-thick-7-2453222.pdf?src-supplier=Digikey; ComponentLink6Description: https://datasheet.ciiva.com/2453/pyu-r-int-thick-7-2453222.pdf?src-supplier=Digikey; ComponentLink7URL: https://datasheet.ciiva.com/15189/getdatasheetpartid-323834-15189867.pdf?src-supplier=Verical; ComponentLink7Description: https://datasheet.ciiva.com/15189/getdatasheetpartid-323834-15189867.pdf?src-supplier=Verical
R26 R30-R36 = RES 10K 0603: Fixed Resistor, Metal Glaze/thick Film, 0.1W, 10000ohm, 75V, 1% +/-Tol, 100ppm/Cel, Surface Mount, 0603; Manufacturer: Yageo; Manufacturer Part Number: RC0603FR-0710KL; Additional Feature: LASER TRIMMABLE; Power: 100mW; Rated Temperature: 70°C; Temperature Coefficient: 100ppm/°C; Package Height: 0.45mm; Package Length: 1.6mm; Package Width: 0.8mm; Supplier: Digikey; Supplier Part Number: 311-10.0KHRCT-ND; RoHS: Yes; Category: Chip SMD Resistors; Stock: 6878448; Pricing: 1=0.1, 10=0.019, 50=0.0112, 100=0.0093, 500=0.00622, 1000=0.00532, 5000=0.00382, 10000=0.00335, 25000=0.00287, 35000=0.00278, 50000=0.00257, 125000=0.00232 (USD); Mounting Technology: Surface Mount; Pins: 2; Package Shape: Rectangular; Case/Package: 0603; Terminal Finish: Nickel; Min Operating Temperature: -55°C; Max Operating Temperature: 155°C; Tolerance: 1%; JESD-609 Code: e3; Resistor Type: FIXED RESISTOR; Construction: Chip; Package Style: SMTMeter; Packaging: Tape and Reel; Technology: METAL GLAZE/THICK FILM; Termination: Wraparound; Working Voltage: 75V; Reach SVHC Compliant: Yes; RoHS Compliant: Yes; ComponentLink1URL: https://datasheet.ciiva.com:443/pdfs/VipMasterIC/IC/YAGO/YAGO-S-A0008145938/YAGO-S-A0008145938-1.pdf?src-supplier=IHS+Markit; ComponentLink1Description: https://datasheet.ciiva.com:443/pdfs/VipMasterIC/IC/YAGO/YAGO-S-A0008145938/YAGO-S-A0008145938-1.pdf?src-supplier=IHS+Markit; ComponentLink2URL: http://www.farnell.com/datasheets/2167052.pdf?src-supplier=Farnell; ComponentLink2Description: http://www.farnell.com/datasheets/2167052.pdf?src-supplier=Farnell; ComponentLink3URL: http://www.farnell.com/datasheets/1868787.pdf?src-supplier=Farnell; ComponentLink3Description: http://www.farnell.com/datasheets/1868787.pdf?src-supplier=Farnell; ComponentLink4URL: http://www.farnell.com/datasheets/443971.pdf?src-supplier=Farnell; ComponentLink4Description: http://www.farnell.com/datasheets/443971.pdf?src-supplier=Farnell; ComponentLink5URL: http://www.yageo.com/documents/recent/PYu-RC_Group_51_RoHS_L_10.pdf?src-supplier=Digikey; ComponentLink5Description: http://www.yageo.com/documents/recent/PYu-RC_Group_51_RoHS_L_10.pdf?src-supplier=Digikey; ComponentLink6URL: http://www.yageo.com/documents/recent/PYu-RC_Group_51_RoHS_L_9.pdf?src-supplier=Component+Sense; ComponentLink6Description: http://www.yageo.com/documents/recent/PYu-RC_Group_51_RoHS_L_9.pdf?src-supplier=Component+Sense
R27-R29 = RES 0R 0402: Metal Glaze/thick Film, 0.0625W, 0ohm, Surface Mount, 0402; Manufacturer: Yageo; Manufacturer Part Number: RC0402JR-070RL; Power: 62.5mW; Rated Temperature: 70°C; Package Height: 0.35mm; Package Length: 1mm; Package Width: 0.5mm; Supplier: Digikey; Supplier Part Number: 311-0.0JRCT-ND; RoHS: Yes; Category: Chip SMD Resistors; Stock: 15179907; Pricing: 1=0.1, 10=0.011, 25=0.0084, 50=0.0064, 100=0.0045, 250=0.00364, 500=0.0029, 1000=0.00214, 5000=0.00154, 10000=0.00133, 30000=0.00117, 50000=0.00107, 100000=0.00105 (USD); Mounting Technology: Surface Mount; Pins: 2; Package Shape: Rectangular; Case/Package: 0402; Terminal Finish: Nickel; Min Operating Temperature: -55°C; Max Operating Temperature: 155°C; JESD-609 Code: e3; Resistor Type: FIXED RESISTOR; Construction: Chip; Package Style: SMTMeter; Packaging: Tape and Reel; Technology: METAL GLAZE/THICK FILM; Termination: Wraparound; Reach SVHC Compliant: Yes; RoHS Compliant: Yes; ComponentLink1URL: https://datasheet.ciiva.com:443/pdfs/VipMasterIC/IC/YAGO/YAGO-S-A0008145938/YAGO-S-A0008145938-1.pdf?src-supplier=IHS+Markit; ComponentLink1Description: https://datasheet.ciiva.com:443/pdfs/VipMasterIC/IC/YAGO/YAGO-S-A0008145938/YAGO-S-A0008145938-1.pdf?src-supplier=IHS+Markit; ComponentLink2URL: https://datasheet.ciiva.com/2452/pyu-rc0402-51-rohs-l-6-2452608.pdf?src-supplier=Digikey; ComponentLink2Description: https://datasheet.ciiva.com/2452/pyu-rc0402-51-rohs-l-6-2452608.pdf?src-supplier=Digikey; ComponentLink3URL: https://datasheet.ciiva.com/11808/0900766b80c66297-11808195.pdf?src-supplier=Rs; ComponentLink3Description: https://datasheet.ciiva.com/11808/0900766b80c66297-11808195.pdf?src-supplier=Rs; ComponentLink4URL: https://datasheet.ciiva.com/2452/pyu-r-int-thick-7-2452609.pdf?src-supplier=Digikey; ComponentLink4Description: https://datasheet.ciiva.com/2452/pyu-r-int-thick-7-2452609.pdf?src-supplier=Digikey; ComponentLink5URL: https://datasheet.ciiva.com/2452/pyu-r-int-thick-7-2452610.pdf?src-supplier=Digikey; ComponentLink5Description: https://datasheet.ciiva.com/2452/pyu-r-int-thick-7-2452610.pdf?src-supplier=Digikey; ComponentLink6URL: https://datasheet.ciiva.com/8896/pyu-rc0402-51-rohs-l-6-8896201.pdf?src-supplier=Avnet; ComponentLink6Description: https://datasheet.ciiva.com/8896/pyu-rc0402-51-rohs-l-6-8896201.pdf?src-supplier=Avnet; ComponentLink7URL: https://datasheet.ciiva.com/7983/1018594-7983535.pdf?src-supplier=Element14; ComponentLink7Description: https://datasheet.ciiva.com/7983/1018594-7983535.pdf?src-supplier=Element14; ComponentLink8URL: https://datasheet.ciiva.com/22747/1018594-22747515.pdf?src-supplier=Element14; ComponentLink8Description: https://datasheet.ciiva.com/22747/1018594-22747515.pdf?src-supplier=Element14
R38 = RES 100R 0603: as R6 on sheet  EFR32_IO; Supplier: Digikey; Supplier Part Number: 311-100HRCT-ND; RoHS: Yes; Category: Chip SMD Resistors; Stock: 2134400; Pricing: 1=0.1, 10=0.019, 50=0.0112, 100=0.0093, 500=0.00622, 1000=0.00532, 5000=0.00382, 10000=0.00335, 25000=0.00287, 35000=0.00278, 50000=0.00257, 125000=0.00232 (USD); Mounting Technology: Surface Mount; Pins: 2; Package Shape: Rectangular; Case/Package: 0603; Terminal Finish: Nickel; Min Operating Temperature: -55°C; Max Operating Temperature: 155°C; Tolerance: 1%; JESD-609 Code: e3; Resistor Type: FIXED RESISTOR; Construction: Chip; Package Style: SMTMeter; Packaging: Tape and Reel; Technology: METAL GLAZE/THICK FILM; Termination: Wraparound; Working Voltage: 75V; Reach SVHC Compliant: Yes; RoHS Compliant: Yes; ComponentLink1URL: https://datasheet.ciiva.com:443/pdfs/VipMasterIC/IC/YAGO/YAGO-S-A0008145938/YAGO-S-A0008145938-1.pdf?src-supplier=IHS+Markit; ComponentLink1Description: https://datasheet.ciiva.com:443/pdfs/VipMasterIC/IC/YAGO/YAGO-S-A0008145938/YAGO-S-A0008145938-1.pdf?src-supplier=IHS+Markit
S2 = SPST: as S1 on sheet  EFR32_IO; Supplier: Digikey; Supplier Part Number: EG1868CT-ND; RoHS: Yes; Category: Tactile Switches; Stock: 45667; Pricing: 1=0.42, 10=0.404, 25=0.3804, 100=0.3303, 250=0.29968, 500=0.27876 (USD); Mounting Technology: Surface Mount; Terminal Finish: Silver; JESD-609 Code: e4; Packaging: Tape and Reel; Switch Action: MOMENTARY-TACTILE; Switch Function: SPST; Switch Type: Keypad; Termination: Solder; Reach SVHC Compliant: Yes; RoHS Compliant: Yes; ComponentLink1URL: https://datasheet.ciiva.com:443/pdfs/VipMasterIC/IC/ESCH/ESCH-S-A0005350531/ESCH-S-A0005350531-1.pdf?src-supplier=IHS+Markit; ComponentLink1Description: https://datasheet.ciiva.com:443/pdfs/VipMasterIC/IC/ESCH/ESCH-S-A0005350531/ESCH-S-A0005350531-1.pdf?src-supplier=IHS+Markit; ComponentLink2URL: https://datasheet.ciiva.com/2901/p010517e-2901296.pdf?src-supplier=Digikey; ComponentLink2Description: https://datasheet.ciiva.com/2901/p010517e-2901296.pdf?src-supplier=Digikey; ComponentLink3URL: https://datasheet.ciiva.com/2901/tl3301-2901294.pdf?src-supplier=Digikey; ComponentLink3Description: https://datasheet.ciiva.com/2901/tl3301-2901294.pdf?src-supplier=Digikey; ComponentLink4URL: https://datasheet.ciiva.com/2901/tl3301-2901295.pdf?src-supplier=Digikey; ComponentLink4Description: https://datasheet.ciiva.com/2901/tl3301-2901295.pdf?src-supplier=Digikey; ComponentLink5URL: https://datasheet.ciiva.com/7637/tl3301-7637661.pdf?src-supplier=Element14; ComponentLink5Description: https://datasheet.ciiva.com/7637/tl3301-7637661.pdf?src-supplier=Element14